# EAGLE schematic digispark_shield_led_matrix (EAGLE 6.2)
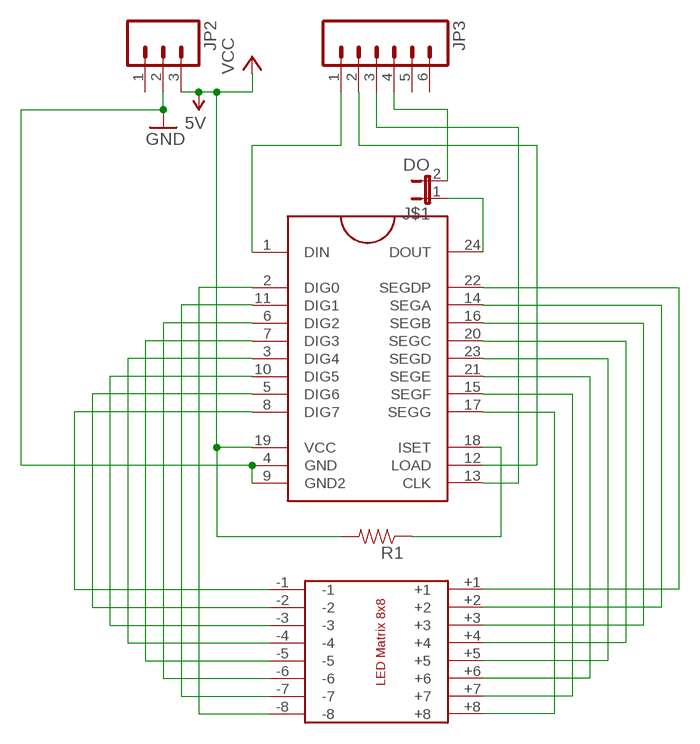
[diagram p0: schematic, sheet 1]

## Parts
J$1  DO  JUMPER-2SMD-NO  [SJ_2S-NO]
JP2  M03PTH  [1X03]
JP3  M06SIP  [1X06]
R1  RESISTORAXIAL-0.3  [AXIAL-0.3]
U$1  LED_ARRAY_8X8  [LED_8X8_2MM_BL-M07C881]
U$2  MAX7219  [SO-24W]

## Nets
GND: JP2.2 U$2.4(GND) U$2.9(GND2)
N$1: R1.P$1 U$2.18(ISET)
N$2: JP3.1 U$2.1(DIN)
N$3: JP3.2 U$2.12(LOAD)
N$4: JP3.3 U$2.13(CLK)
N$5: U$1.-8 U$2.2(DIG0)
N$6: U$1.-7 U$2.11(DIG1)
N$7: U$1.-6 U$2.6(DIG2)
N$8: U$1.-5 U$2.7(DIG3)
N$9: U$1.-4 U$2.3(DIG4)
N$10: U$1.-3 U$2.10(DIG5)
N$11: U$1.-2 U$2.5(DIG6)
N$12: U$1.-1 U$2.8(DIG7)
N$13: U$1.+8 U$2.17(SEGG)
N$14: U$1.+7 U$2.15(SEGF)
N$15: U$1.+6 U$2.21(SEGE)
N$16: U$1.+5 U$2.23(SEGD)
N$17: U$1.+4 U$2.20(SEGC)
N$18: U$1.+3 U$2.16(SEGB)
N$19: U$1.+2 U$2.14(SEGA)
N$20: U$1.+1 U$2.22(SEGDP)
N$21: J$1.1 U$2.24(DOUT)
N$22: J$1.2 JP3.4
VCC: JP2.3 R1.P$2 U$2.19(VCC) ; supply symbol labelled 5V
Unconnected: JP2.1 JP3.5 JP3.6

## Library data of the parts
J$1 = SparkFun:JUMPER-2: Jumper Basic 0.1" spaced jumper. Use with breakaway headers.
JP2 = SparkFun:M03: Header 3 Standard 3-pin 0.1" header. Use with straight break away headers (SKU : PRT-00116), right angle break away headers (PRT-00553), swiss pins (PRT-00743), machine pins (PRT-00117), and female headers (PRT-00115). Molex polarized connector foot print use with SKU : PRT-08232 with associated crimp pins and housings.
JP3 = SparkFun:M06: Header 6 Standard 6-pin 0.1" header. Use with straight break away headers (SKU : PRT-00116), right angle break away headers (PRT-00553), swiss pins (PRT-00743), machine pins (PRT-00117), and female headers (PRT-00115). Molex polarized connector foot print use with SKU : PRT-08094 with associated crimp pins and housings. NOTES ON THE VARIANTS LOCK and LOCK_LONGPADS... This footprint was designed to help hold the alignment of a through-hole component (i.e. 6-pin header) while soldering it into place. You may notice that each hole has been shifted either up or down by 0.005 of an inch from it's more standard position (which is a perfectly straight line). This slight alteration caused the pins (the squares in the middle) to touch the edges of the holes. Because they are alternating, it causes a "brace" to hold the component in place. 0.005 has proven to be the perfect amount of "off-center" position when using our standard breakaway headers. Although looks a little odd when you look at the bare footprint, once you have a header in there, the alteration is very hard to notice. Also, if you push a header all the way into place, it is covered up entirely on the bottom side. This idea of altering the position of holes to aid alignment will be further integrated into the Sparkfun Library for other footprints. It can help hold any component with 3 or more connection pins.
R1 = SparkFun:RESISTOR: Resistor Basic schematic elements and footprints for 0603, 1206, and PTH resistors.
U$1 = sparr:LED_ARRAY_8X8
U$2 = SparkFun:MAX7219